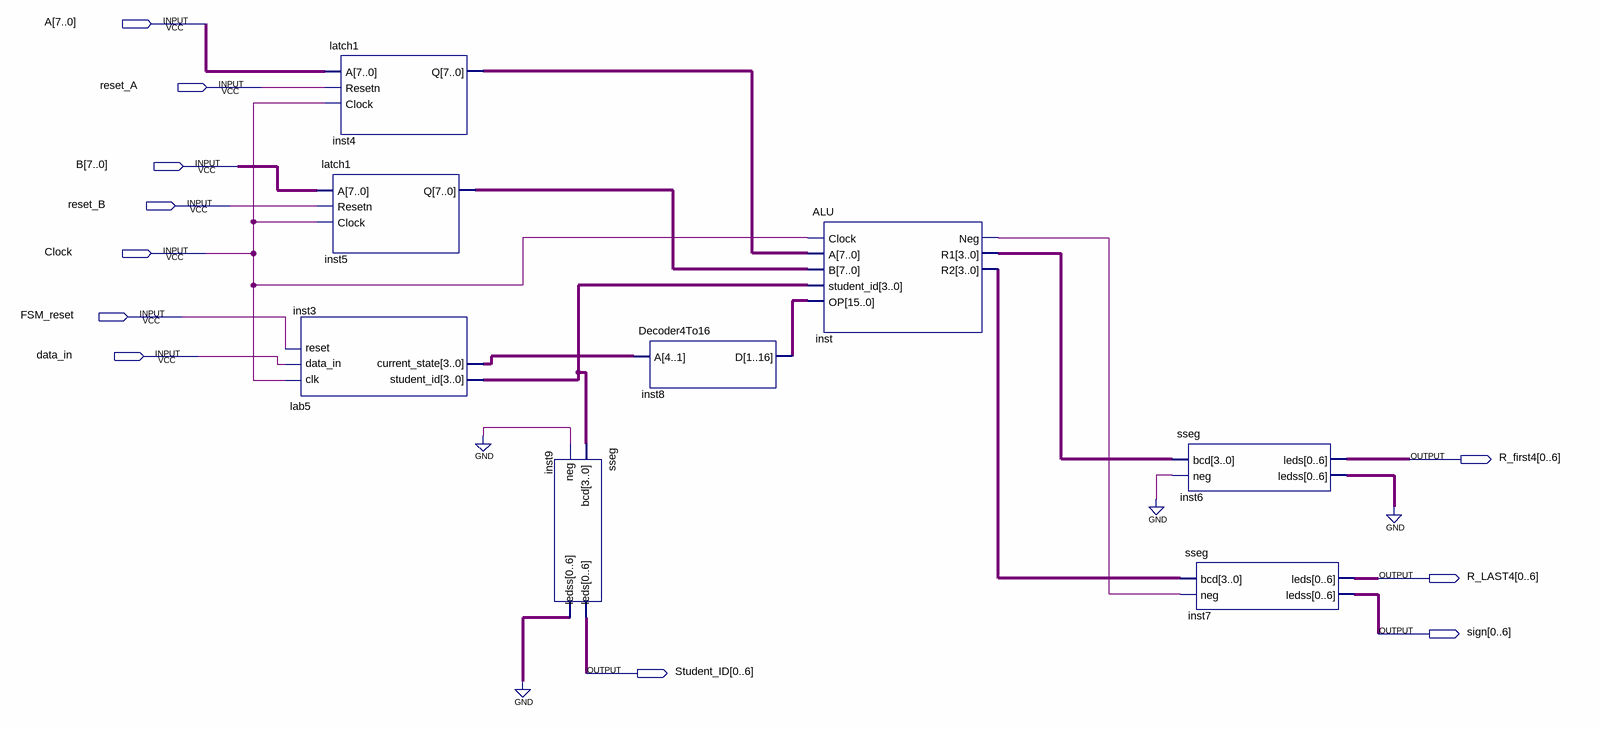
[diagram p0: schematic sheet]
// Quartus schematic CiruitProblem1.bdf as structural Verilog: 8 symbols, 11 pins
module CiruitProblem1 (
  input  [7:0] A,
  input  reset_A,
  input  [7:0] B,
  input  reset_B,
  input  Clock,
  input  FSM_reset,
  input  data_in,
  output [0:6] R_first4,
  output [0:6] R_LAST4,
  output [0:6] sign,
  output [0:6] Student_ID
);

  wire inst_neg;
  wire [3:0] inst3_current_state, inst3_student_id, inst_r1, inst_r2;
  wire [6:0] inst6_ledss, inst9_ledss;
  wire [7:0] inst4_q, inst5_q;
  wire [15:0] inst8_d;

  lab5 inst3 (
    .clk(Clock), .data_in(data_in), .reset(FSM_reset), .student_id(inst3_student_id),
    .current_state(inst3_current_state));
  latch1 inst4 (.A(A), .Resetn(reset_A), .Clock(Clock), .Q(inst4_q));
  latch1 inst5 (.A(B), .Resetn(reset_B), .Clock(Clock), .Q(inst5_q));
  sseg inst9 (.bcd(inst3_student_id), .neg(1'b0), .leds(Student_ID), .ledss(inst9_ledss));
  Decoder4To16 inst8 (.A(inst3_current_state), .D(inst8_d));
  ALU inst (
    .Clock(Clock), .A(inst4_q), .B(inst5_q), .student_id(inst3_student_id), .OP(inst8_d), .Neg(inst_neg),
    .R1(inst_r1), .R2(inst_r2));
  sseg inst6 (.bcd(inst_r1), .neg(1'b0), .leds(R_first4), .ledss(inst6_ledss));
  sseg inst7 (.bcd(inst_r2), .neg(inst_neg), .leds(R_LAST4), .ledss(sign));
  // also tied to GND on the sheet: {inst6_ledss[0], inst6_ledss[1], inst6_ledss[2], inst6_ledss[3], inst6_ledss[4], inst6_ledss[5], inst6_ledss[6], inst9_ledss[0], inst9_ledss[1], inst9_ledss[2], inst9_ledss[3], inst9_ledss[4], inst9_ledss[5], inst9_ledss[6]}
endmodule
